# Altium schematic sheet Sheet1.SchDoc
size A4
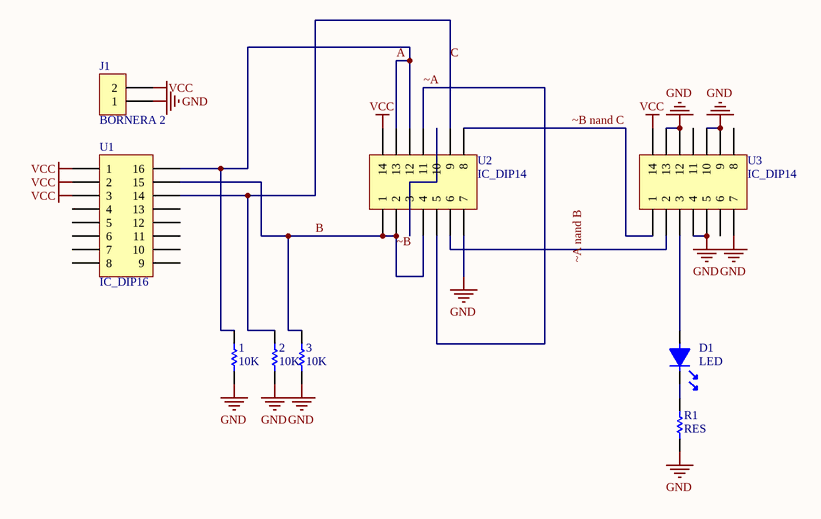
[diagram p0: Sheet1.SchDoc]

## Parts
1  10K  [RES400]
2  10K  [RES400]
3  10K  [RES400]
D1  LED  [LED3]
J1  BORNERA 2  [BORNERA2]
R1  RES  [RES400]
U1  IC_DIP16  [DIP16]
U2  IC_DIP14  [DIP14]
U3  IC_DIP14  [DIP14]

## Nets
GND: 1.2 2.2 3.2 J1.1 R1.1 U2.7 U3.4 U3.5 U3.7 U3.9 U3.10 U3.12 U3.13
VCC: J1.2 U1.1 U1.2 U1.3 U2.14 U3.14
A: 1.1 U1.16 U2.12 U2.13
B: 3.1 U1.15 U2.1 U2.2 U2.4  [also labelled ~B]
C: 2.1 U1.14 U2.9
~A: U2.5 U2.11
~B nand C: U2.8 U3.1
NetD1_1: D1.1 U3.3
NetD1_2: D1.2 R1.2
NetU2_3: U2.3 U2.10
NetU2_6: U2.6 U3.2

Not connected (* = marked no-connect by the designer): U1 4 5 6 7 8 9 10 11 12 13; U3 6 8 11

## Notes on the sheet
- Labels drawn without touching a wire or pin: ~A nand B

## Library data of the parts
1-3 = RES